# Altium schematic sheet scc1002_main.SchDoc
size A4; DrawnBy: Marco
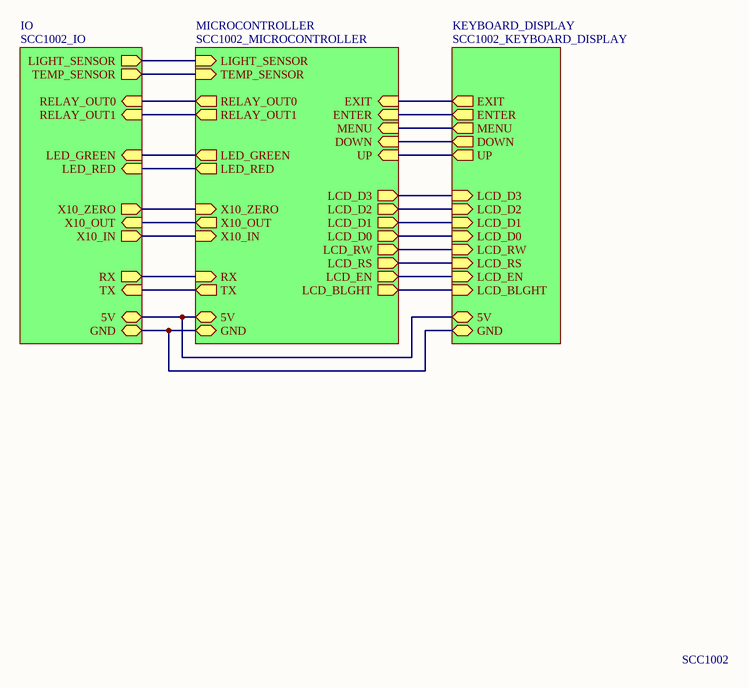
[diagram p0: scc1002_main.SchDoc]

## Sub-sheets
IO = SCC1002_IO: LIGHT_SENSOR (out), TEMP_SENSOR (out), RELAY_OUT0 (in), RELAY_OUT1 (in), LED_GREEN (in), LED_RED (in), X10_ZERO (out), X10_OUT (in), X10_IN (out), RX (out), TX (in), GND, 5V
KEYBOARD_DISPLAY = SCC1002_KEYBOARD_DISPLAY: EXIT (out), ENTER (out), MENU (out), DOWN (out), UP (out), LCD_D3 (in), LCD_D2 (in), LCD_D1 (in), LCD_D0 (in), LCD_RW (in), LCD_RS (in), LCD_EN (in), GND, 5V, LCD_BLGHT (in)
MICROCONTROLLER = SCC1002_MICROCONTROLLER: EXIT (in), ENTER (in), MENU (in), DOWN (in), UP (in), LCD_D3 (out), LCD_D2 (out), LCD_D1 (out), LCD_D0 (out), LCD_RW (out), LCD_RS (out), LCD_EN (out), LIGHT_SENSOR (in), TEMP_SENSOR (in), RELAY_OUT0 (out), RELAY_OUT1 (out), LED_GREEN (out), LED_RED (out), X10_ZERO (in), X10_OUT (out), X10_IN (in), RX (in), TX (out), GND, 5V, LCD_BLGHT (out)

## Nets
(unnamed): sheet MICROCONTROLLER/EXIT, sheet KEYBOARD_DISPLAY/EXIT
(unnamed): sheet MICROCONTROLLER/ENTER, sheet KEYBOARD_DISPLAY/ENTER
(unnamed): sheet MICROCONTROLLER/MENU, sheet KEYBOARD_DISPLAY/MENU
(unnamed): sheet MICROCONTROLLER/DOWN, sheet KEYBOARD_DISPLAY/DOWN
(unnamed): sheet MICROCONTROLLER/UP, sheet KEYBOARD_DISPLAY/UP
(unnamed): sheet MICROCONTROLLER/LCD_D3, sheet KEYBOARD_DISPLAY/LCD_D3
(unnamed): sheet MICROCONTROLLER/LCD_D2, sheet KEYBOARD_DISPLAY/LCD_D2
(unnamed): sheet MICROCONTROLLER/LCD_D1, sheet KEYBOARD_DISPLAY/LCD_D1
(unnamed): sheet MICROCONTROLLER/LCD_D0, sheet KEYBOARD_DISPLAY/LCD_D0
(unnamed): sheet MICROCONTROLLER/LCD_RW, sheet KEYBOARD_DISPLAY/LCD_RW
(unnamed): sheet MICROCONTROLLER/LCD_RS, sheet KEYBOARD_DISPLAY/LCD_RS
(unnamed): sheet MICROCONTROLLER/LCD_EN, sheet KEYBOARD_DISPLAY/LCD_EN
(unnamed): sheet MICROCONTROLLER/LIGHT_SENSOR, sheet IO/LIGHT_SENSOR
(unnamed): sheet MICROCONTROLLER/TEMP_SENSOR, sheet IO/TEMP_SENSOR
(unnamed): sheet MICROCONTROLLER/RELAY_OUT0, sheet IO/RELAY_OUT0
(unnamed): sheet MICROCONTROLLER/RELAY_OUT1, sheet IO/RELAY_OUT1
(unnamed): sheet MICROCONTROLLER/LED_GREEN, sheet IO/LED_GREEN
(unnamed): sheet MICROCONTROLLER/LED_RED, sheet IO/LED_RED
(unnamed): sheet MICROCONTROLLER/X10_ZERO, sheet IO/X10_ZERO
(unnamed): sheet MICROCONTROLLER/X10_OUT, sheet IO/X10_OUT
(unnamed): sheet MICROCONTROLLER/X10_IN, sheet IO/X10_IN
(unnamed): sheet MICROCONTROLLER/RX, sheet IO/RX
(unnamed): sheet MICROCONTROLLER/TX, sheet IO/TX
(unnamed): sheet MICROCONTROLLER/GND, sheet KEYBOARD_DISPLAY/GND, sheet IO/GND
(unnamed): sheet MICROCONTROLLER/5V, sheet KEYBOARD_DISPLAY/5V, sheet IO/5V
(unnamed): sheet MICROCONTROLLER/LCD_BLGHT, sheet KEYBOARD_DISPLAY/LCD_BLGHT

## Notes on the sheet
- SCC1002